# EAGLE schematic Dilbert-Badge (EAGLE 6.5.0)
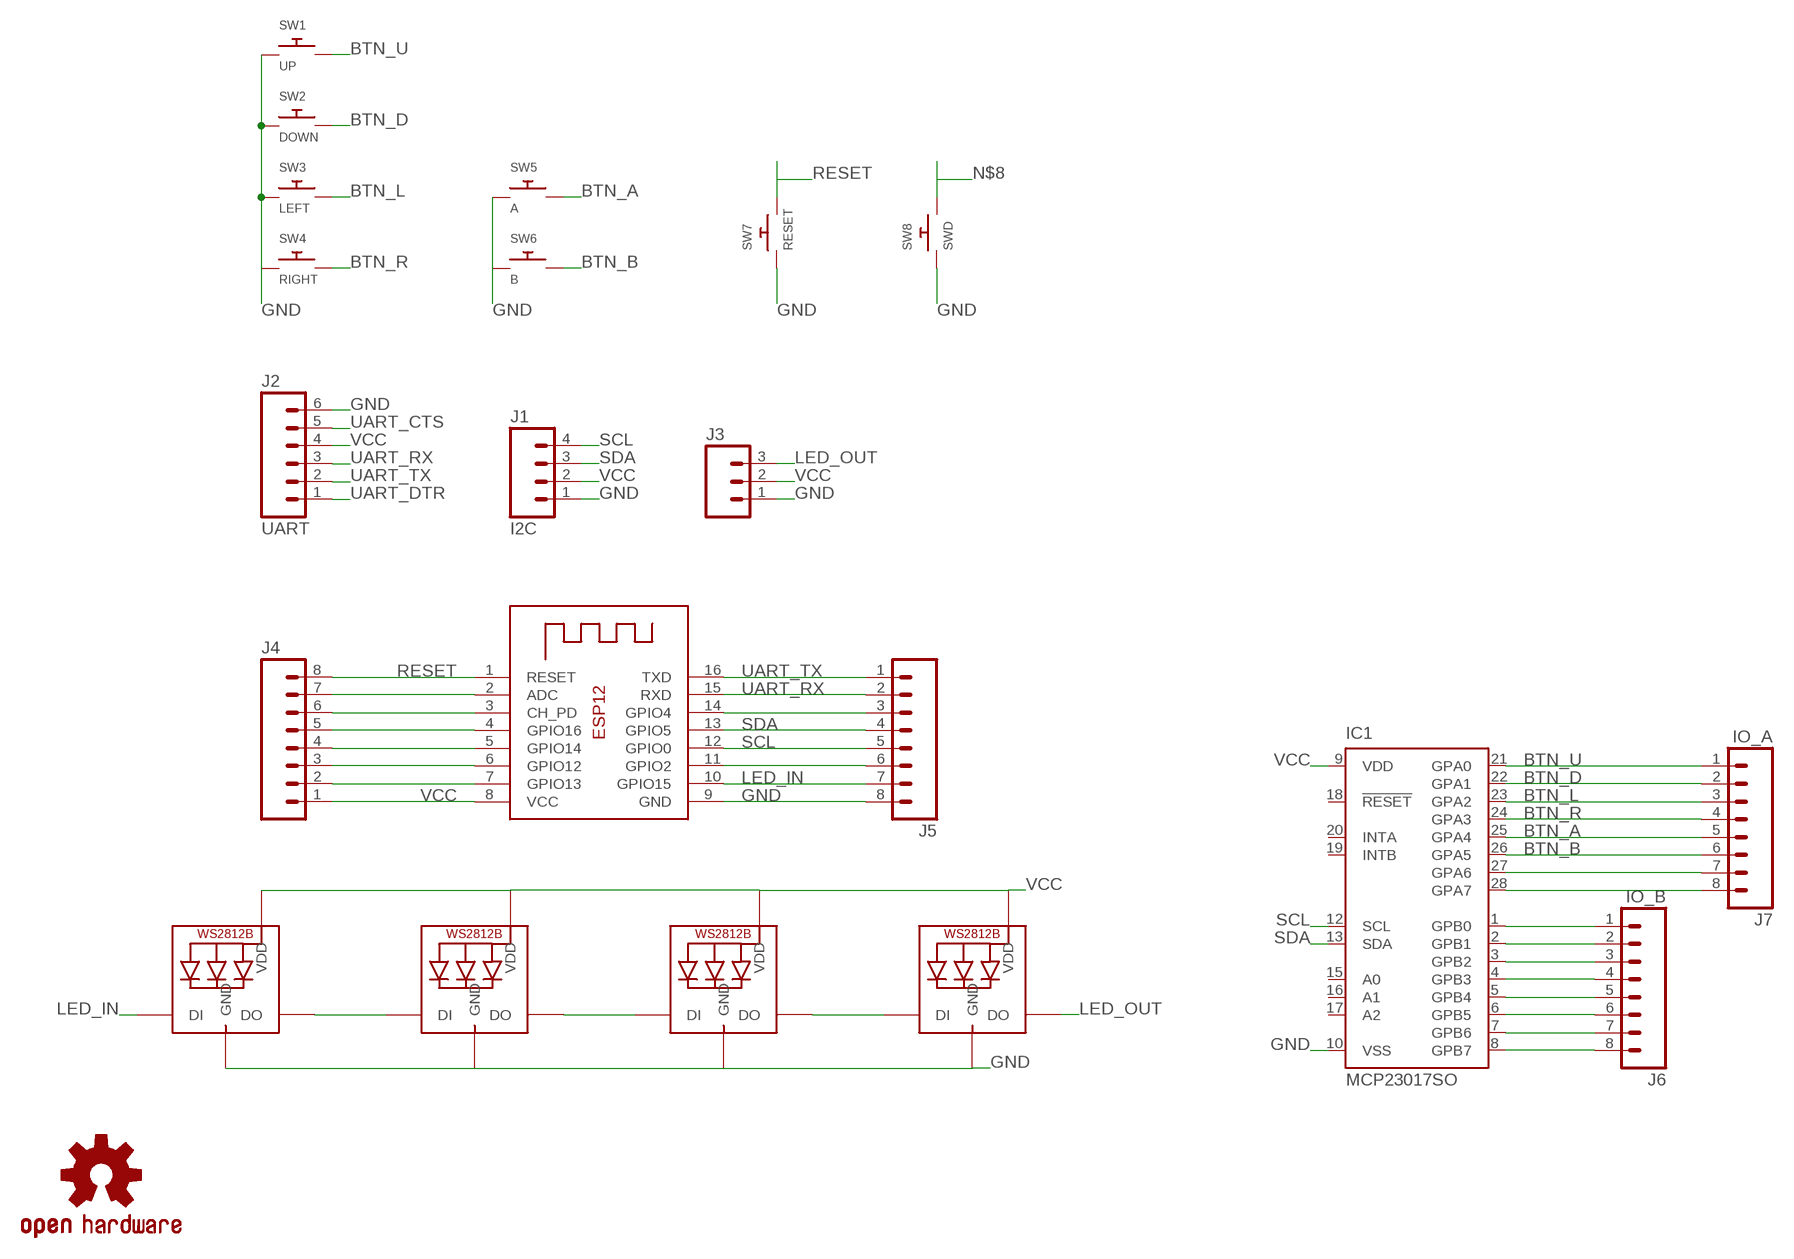
[diagram p0: schematic, sheet 1]

## Parts
IC1  MCP23017SO  [SO28W]
J1  I2C  M04PTH  [1X04]
J2  UART  M06SILK_FEMALE_PTH  [1X06]
J3  M03PTH  [1X03]
J4  M08NO_SILK_FEMALE_PTH  [1X08_NO_SILK]
J5  M08NO_SILK_FEMALE_PTH  [1X08_NO_SILK]
J6  IO_B  M08  [1X08_ROUND]
J7  IO_A  M08  [1X08_ROUND]
LED1  WS2812B5050  [WS2812B]
LED2  WS2812B5050  [WS2812B]
LED3  WS2812B5050  [WS2812B]
LED4  WS2812B5050  [WS2812B]
LOGO1  OSHW-LOGOL  [OSHW-LOGO-L]
SW1  UP  SWITCH_PUSHBUTTONEVQ-PE  [TACT_PANA-EVQ]
SW2  DOWN  SWITCH_PUSHBUTTONEVQ-PE  [TACT_PANA-EVQ]
SW3  LEFT  SWITCH_PUSHBUTTONEVQ-PE  [TACT_PANA-EVQ]
SW4  RIGHT  SWITCH_PUSHBUTTONEVQ-PE  [TACT_PANA-EVQ]
SW5  A  SWITCH_PUSHBUTTONEVQ-PE  [TACT_PANA-EVQ]
SW6  B  SWITCH_PUSHBUTTONEVQ-PE  [TACT_PANA-EVQ]
SW7  RESET  SWITCH_PUSHBUTTONEVQ-PE  [TACT_PANA-EVQ]
SW8  SWD  SWITCH_PUSHBUTTONEVQ-PE  [TACT_PANA-EVQ]
X1  ESP-12  [ESP-12]

## Nets
BTN_A: IC1.25(GPA4) J7.5 SW5.P$2
BTN_B: IC1.26(GPA5) J7.6 SW6.P$2
BTN_D: IC1.22(GPA1) J7.2 SW2.P$2
BTN_L: IC1.23(GPA2) J7.3 SW3.P$2
BTN_R: IC1.24(GPA3) J7.4 SW4.P$2
BTN_U: IC1.21(GPA0) J7.1 SW1.P$2
GND: IC1.10(VSS) J1.1 J2.6 J3.1 J5.8 LED1.3-GND(GND) LED2.3-GND(GND) LED3.3-GND(GND) LED4.3-GND(GND) SW1.P$1 SW2.P$1 SW3.P$1 SW4.P$1 SW5.P$1 SW6.P$1 SW7.P$1 SW8.P$1 X1.9(GND)
LED_IN: J5.7 LED1.4-DIN(DI) X1.10(GPIO15)
LED_OUT: J3.3 LED4.2-DOUT(DO)
N$1: LED1.2-DOUT(DO) LED2.4-DIN(DI)
N$2: LED2.2-DOUT(DO) LED3.4-DIN(DI)
N$3: LED3.2-DOUT(DO) LED4.4-DIN(DI)
N$4: J4.7 X1.2(ADC)
N$6: J4.6 X1.3(CH_PD)
N$7: J4.5 X1.4(GPIO16)
N$8: SW8.P$2
N$9: J4.4 X1.5(GPIO14)
N$10: J4.2 X1.7(GPIO13)
N$11: J4.3 X1.6(GPIO12)
N$12: J5.3 X1.14(GPIO4)
N$13: J5.6 X1.11(GPIO2)
N$14: IC1.1(GPB0) J6.1
N$15: IC1.2(GPB1) J6.2
N$16: IC1.8(GPB7) J6.8
N$17: IC1.7(GPB6) J6.7
N$18: IC1.6(GPB5) J6.6
N$19: IC1.5(GPB4) J6.5
N$20: IC1.4(GPB3) J6.4
N$21: IC1.3(GPB2) J6.3
N$22: IC1.28(GPA7) J7.8
N$23: IC1.27(GPA6) J7.7
RESET: J4.8 SW7.P$2 X1.1(RESET)
SCL: IC1.12(SCL) J1.4 J5.5 X1.12(GPIO0)
SDA: IC1.13(SDA) J1.3 J5.4 X1.13(GPIO5)
UART_CTS: J2.5
UART_DTR: J2.1
UART_RX: J2.3 J5.2 X1.15(RXD)
UART_TX: J2.2 J5.1 X1.16(TXD)
VCC: IC1.9(VDD) J1.2 J2.4 J3.2 J4.1 LED1.1-VDD(VDD) LED2.1-VDD(VDD) LED3.1-VDD(VDD) LED4.1-VDD(VDD) X1.8(VCC)
Unconnected: IC1.15(A0) IC1.16(A1) IC1.17(A2) IC1.18(!RESET) IC1.19(INTB) IC1.20(INTA)

## Library data of the parts
IC1 = adafruit:MCP23017: http://ww1.microchip.com/downloads/en/DeviceDoc/21952a.pdf Source: http://ww1.microchip.com/downloads/en/DeviceDoc/21952a.pdf
J1 = SparkFun-Connectors:M04: Header 4 Standard 4-pin 0.1" header. Use with straight break away headers (SKU : PRT-00116), right angle break away headers (PRT-00553), swiss pins (PRT-00743), machine pins (PRT-00117), and female headers (PRT-00115). Molex polarized connector foot print use with SKU : PRT-08231 with associated crimp pins and housings. 1MM SMD Version SKU: PRT-10208; PROD_ID: CONN-09696
J2 = SparkFun-Connectors:M06: Header 6 Standard 6-pin 0.1" header. Use with straight break away headers (SKU : PRT-00116), right angle break away headers (PRT-00553), swiss pins (PRT-00743), machine pins (PRT-00117), and female headers (PRT-00115). Molex polarized connector foot print use with SKU : PRT-08094 with associated crimp pins and housings. NOTES ON THE VARIANTS LOCK and LOCK_LONGPADS... This footprint was designed to help hold the alignment of a through-hole component (i.e. 6-pin header) while soldering it into place. You may notice that each hole has been shifted either up or down by 0.005 of an inch from it's more standard position (which is a perfectly straight line). This slight alteration caused the pins (the squares in the middle) to touch the edges of the holes. Because they are alternating, it causes a "brace" to hold the component in place. 0.005 has proven to be the perfect amount of "off-center" position when using our standard breakaway headers. Although looks a little odd when you look at the bare footprint, once you have a header in there, the alteration is very hard to notice. Also,if you push a header all the way into place, it is covered up entirely on the bottom side. This idea of altering the position of holes to aid alignment will be further integrated into the Sparkfun Library for other footprints. It can help hold any component with 3 or more connection pins.; PROD_ID: CONN-08437
J3 = SparkFun-Connectors:M03: Header 3 Standard 3-pin 0.1" header. Use with straight break away headers (SKU : PRT-00116), right angle break away headers (PRT-00553), swiss pins (PRT-00743), machine pins (PRT-00117), and female headers (PRT-00115). Molex polarized connector foot print use with SKU : PRT-08232 with associated crimp pins and housings.
J4 J5 = SparkFun-Connectors:M08: Header 8 Standard 8-pin 0.1" header. Use with straight break away headers (SKU : PRT-00116), right angle break away headers (PRT-00553), swiss pins (PRT-00743), machine pins (PRT-00117), and female headers (PRT-00115).; PROD_ID: CONN-08438
J6 J7 = SparkFun-Connectors:M08: Header 8 Standard 8-pin 0.1" header. Use with straight break away headers (SKU : PRT-00116), right angle break away headers (PRT-00553), swiss pins (PRT-00743), machine pins (PRT-00117), and female headers (PRT-00115).; PROD_ID: CONN-08437
LED1-LED4 = adafruit:WS2812B
LOGO1 = SparkFun-Aesthetics:OSHW-LOGO: Open Source Hardware Logo This logo indicates the piece of hardware it is found on incorporates a OSHW license and/or adheres to the definition of open source hardware found here: http://freedomdefined.org/OSHW
SW1-SW8 = adafruit:SWITCH_PUSHBUTTON: Buttons SOFTTOUCHSMD_SJ - Soft touch temporary push button (Super Junk Akihabara) Compatible with SKPMANE010 [Mouser: 688-SKPMAN] C&K_KSS = Digikey: KSS221GLFS
X1 = adafruit:ESP-12